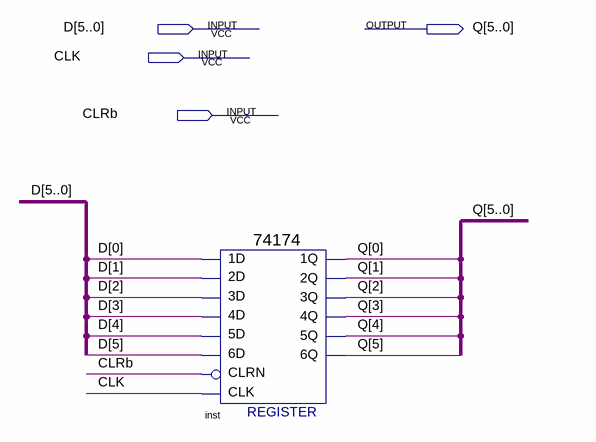
[diagram p0: schematic sheet]
// Quartus schematic ttl74174.bdf as structural Verilog: 1 symbols, 4 pins
module ttl74174 (
  input  [5:0] D,
  input  CLK,
  input  CLRb,
  output [5:0] Q
);

  \74174  inst (
    .\4D (D[3]), .\3D (D[2]), .\5D (D[4]), .\6D (D[5]), .CLK(CLK), .CLRN(CLRb), .\1D (D[0]), .\2D (D[1]),
    .\1Q (Q[0]), .\4Q (Q[3]), .\3Q (Q[2]), .\2Q (Q[1]), .\6Q (Q[5]), .\5Q (Q[4]));
endmodule
